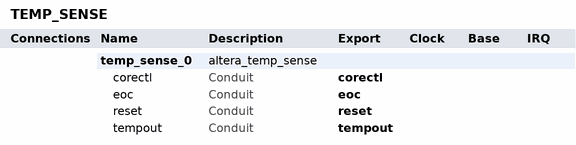
[diagram p0: system contents]
# Platform Designer (Qsys) system TEMP_SENSE, Arria 10 10AS048H3F34I2SG
# Parameters at their usual value, and those the tool derives, are not listed.
package require -exact qsys 17.0
create_system TEMP_SENSE
set_project_property DEVICE_FAMILY {Arria 10}
set_project_property DEVICE 10AS048H3F34I2SG

add_instance temp_sense_0 altera_temp_sense 17.0
set_instance_property temp_sense_0 AUTO_EXPORT true
set_instance_parameter_value temp_sense_0 CBX_AUTO_BLACKBOX ALL
set_instance_parameter_value temp_sense_0 CE_CHECK false
set_instance_parameter_value temp_sense_0 CLK_FREQUENCY 1.0
set_instance_parameter_value temp_sense_0 CLOCK_DIVIDER_VALUE 40
set_instance_parameter_value temp_sense_0 CLR_CHECK false
set_instance_parameter_value temp_sense_0 NUMBER_OF_SAMPLES 128
set_instance_parameter_value temp_sense_0 POI_CAL_TEMPERATURE 85
set_instance_parameter_value temp_sense_0 SIM_TSDCALO 0
set_instance_parameter_value temp_sense_0 USER_OFFSET_ENABLE off
set_instance_parameter_value temp_sense_0 USE_WYS on

# exported interfaces
add_interface corectl conduit end
set_interface_property corectl EXPORT_OF temp_sense_0.corectl
add_interface eoc conduit end
set_interface_property eoc EXPORT_OF temp_sense_0.eoc
add_interface reset conduit end
set_interface_property reset EXPORT_OF temp_sense_0.reset
add_interface tempout conduit end
set_interface_property tempout EXPORT_OF temp_sense_0.tempout

set_interconnect_requirement {$system} qsys_mm.clockCrossingAdapter HANDSHAKE
set_interconnect_requirement {$system} qsys_mm.enableEccProtection FALSE
set_interconnect_requirement {$system} qsys_mm.insertDefaultSlave FALSE
set_interconnect_requirement {$system} qsys_mm.maxAdditionalLatency 1

save_system TEMP_SENSE.qsys
